# EAGLE design 8bitPig-PigstyGates-FrontPCB (EAGLE 9.2.2)
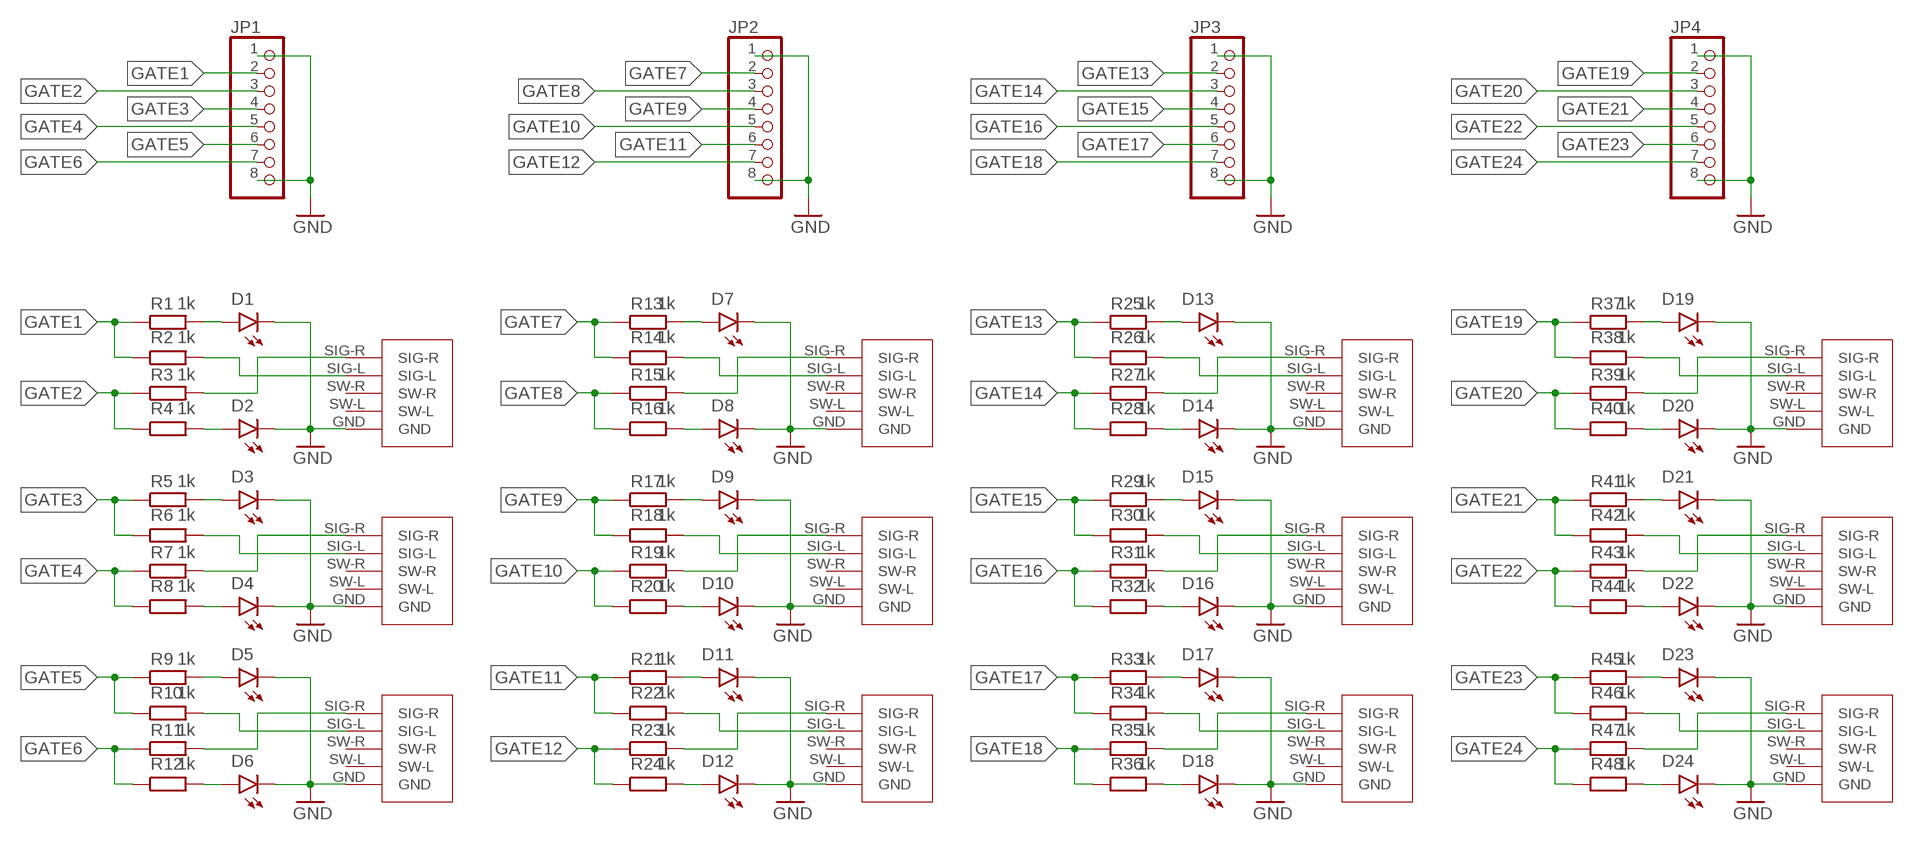
[diagram p0: schematic, sheet 1]

## Parts
D1  LED3MM  [LED_3MM]
D2  LED3MM  [LED_3MM]
D3  LED3MM  [LED_3MM]
D4  LED3MM  [LED_3MM]
D5  LED3MM  [LED_3MM]
D6  LED3MM  [LED_3MM]
D7  LED3MM  [LED_3MM]
D8  LED3MM  [LED_3MM]
D9  LED3MM  [LED_3MM]
D10  LED3MM  [LED_3MM]
D11  LED3MM  [LED_3MM]
D12  LED3MM  [LED_3MM]
D13  LED3MM  [LED_3MM]
D14  LED3MM  [LED_3MM]
D15  LED3MM  [LED_3MM]
D16  LED3MM  [LED_3MM]
D17  LED3MM  [LED_3MM]
D18  LED3MM  [LED_3MM]
D19  LED3MM  [LED_3MM]
D20  LED3MM  [LED_3MM]
D21  LED3MM  [LED_3MM]
D22  LED3MM  [LED_3MM]
D23  LED3MM  [LED_3MM]
D24  LED3MM  [LED_3MM]
DUAL_JACK_1  DUAL_MONO_THONKICONN  [DUAL_THONKICONN_MONO]
DUAL_JACK_2  DUAL_MONO_THONKICONN  [DUAL_THONKICONN_MONO]
DUAL_JACK_3  DUAL_MONO_THONKICONN  [DUAL_THONKICONN_MONO]
DUAL_JACK_4  DUAL_MONO_THONKICONN  [DUAL_THONKICONN_MONO]
DUAL_JACK_5  DUAL_MONO_THONKICONN  [DUAL_THONKICONN_MONO]
DUAL_JACK_6  DUAL_MONO_THONKICONN  [DUAL_THONKICONN_MONO]
DUAL_JACK_7  DUAL_MONO_THONKICONN  [DUAL_THONKICONN_MONO]
DUAL_JACK_8  DUAL_MONO_THONKICONN  [DUAL_THONKICONN_MONO]
DUAL_JACK_9  DUAL_MONO_THONKICONN  [DUAL_THONKICONN_MONO]
DUAL_JACK_10  DUAL_MONO_THONKICONN  [DUAL_THONKICONN_MONO]
DUAL_JACK_11  DUAL_MONO_THONKICONN  [DUAL_THONKICONN_MONO]
DUAL_JACK_12  DUAL_MONO_THONKICONN  [DUAL_THONKICONN_MONO]
JP1  PINHD-1X8  [1X08]
JP2  PINHD-1X8  [1X08]
JP3  PINHD-1X8  [1X08]
JP4  PINHD-1X8  [1X08]
R1  1k  R-EU_R0603  [R0603]
R2  1k  R-EU_R0603  [R0603]
R3  1k  R-EU_R0603  [R0603]
R4  1k  R-EU_R0603  [R0603]
R5  1k  R-EU_R0603  [R0603]
R6  1k  R-EU_R0603  [R0603]
R7  1k  R-EU_R0603  [R0603]
R8  1k  R-EU_R0603  [R0603]
R9  1k  R-EU_R0603  [R0603]
R10  1k  R-EU_R0603  [R0603]
R11  1k  R-EU_R0603  [R0603]
R12  1k  R-EU_R0603  [R0603]
R13  1k  R-EU_R0603  [R0603]
R14  1k  R-EU_R0603  [R0603]
R15  1k  R-EU_R0603  [R0603]
R16  1k  R-EU_R0603  [R0603]
R17  1k  R-EU_R0603  [R0603]
R18  1k  R-EU_R0603  [R0603]
R19  1k  R-EU_R0603  [R0603]
R20  1k  R-EU_R0603  [R0603]
R21  1k  R-EU_R0603  [R0603]
R22  1k  R-EU_R0603  [R0603]
R23  1k  R-EU_R0603  [R0603]
R24  1k  R-EU_R0603  [R0603]
R25  1k  R-EU_R0603  [R0603]
R26  1k  R-EU_R0603  [R0603]
R27  1k  R-EU_R0603  [R0603]
R28  1k  R-EU_R0603  [R0603]
R29  1k  R-EU_R0603  [R0603]
R30  1k  R-EU_R0603  [R0603]
R31  1k  R-EU_R0603  [R0603]
R32  1k  R-EU_R0603  [R0603]
R33  1k  R-EU_R0603  [R0603]
R34  1k  R-EU_R0603  [R0603]
R35  1k  R-EU_R0603  [R0603]
R36  1k  R-EU_R0603  [R0603]
R37  1k  R-EU_R0603  [R0603]
R38  1k  R-EU_R0603  [R0603]
R39  1k  R-EU_R0603  [R0603]
R40  1k  R-EU_R0603  [R0603]
R41  1k  R-EU_R0603  [R0603]
R42  1k  R-EU_R0603  [R0603]
R43  1k  R-EU_R0603  [R0603]
R44  1k  R-EU_R0603  [R0603]
R45  1k  R-EU_R0603  [R0603]
R46  1k  R-EU_R0603  [R0603]
R47  1k  R-EU_R0603  [R0603]
R48  1k  R-EU_R0603  [R0603]

## Nets
GATE1: JP1.2 R1.1 R2.1
GATE2: JP1.3 R3.1 R4.1
GATE3: JP1.4 R5.1 R6.1
GATE4: JP1.5 R7.1 R8.1
GATE5: JP1.6 R9.1 R10.1
GATE6: JP1.7 R11.1 R12.1
GATE7: JP2.2 R13.1 R14.1
GATE8: JP2.3 R15.1 R16.1
GATE9: JP2.4 R17.1 R18.1
GATE10: JP2.5 R19.1 R20.1
GATE11: JP2.6 R21.1 R22.1
GATE12: JP2.7 R23.1 R24.1
GATE13: JP3.2 R25.1 R26.1
GATE14: JP3.3 R27.1 R28.1
GATE15: JP3.4 R29.1 R30.1
GATE16: JP3.5 R31.1 R32.1
GATE17: JP3.6 R33.1 R34.1
GATE18: JP3.7 R35.1 R36.1
GATE19: JP4.2 R37.1 R38.1
GATE20: JP4.3 R39.1 R40.1
GATE21: JP4.4 R41.1 R42.1
GATE22: JP4.5 R43.1 R44.1
GATE23: JP4.6 R45.1 R46.1
GATE24: JP4.7 R47.1 R48.1
GND: D1.K(C) D2.K(C) D3.K(C) D4.K(C) D5.K(C) D6.K(C) D7.K(C) D8.K(C) D9.K(C) D10.K(C) D11.K(C) D12.K(C) D13.K(C) D14.K(C) D15.K(C) D16.K(C) D17.K(C) D18.K(C) D19.K(C) D20.K(C) D21.K(C) D22.K(C) D23.K(C) D24.K(C) DUAL_JACK_1.GND DUAL_JACK_2.GND DUAL_JACK_3.GND DUAL_JACK_4.GND DUAL_JACK_5.GND DUAL_JACK_6.GND DUAL_JACK_7.GND DUAL_JACK_8.GND DUAL_JACK_9.GND DUAL_JACK_10.GND DUAL_JACK_11.GND DUAL_JACK_12.GND JP1.1 JP1.8 JP2.1 JP2.8 JP3.1 JP3.8 JP4.1 JP4.8
N$1: DUAL_JACK_2.SIG-R R7.2
N$2: DUAL_JACK_1.SIG-L R2.2
N$3: D4.A R8.2
N$4: D3.A R5.2
N$5: D1.A R1.2
N$6: DUAL_JACK_2.SIG-L R6.2
N$7: DUAL_JACK_3.SIG-R R11.2
N$8: D6.A R12.2
N$9: D5.A R9.2
N$10: DUAL_JACK_3.SIG-L R10.2
N$11: DUAL_JACK_4.SIG-R R15.2
N$12: D8.A R16.2
N$13: D7.A R13.2
N$14: DUAL_JACK_4.SIG-L R14.2
N$15: DUAL_JACK_5.SIG-R R19.2
N$16: D10.A R20.2
N$17: DUAL_JACK_1.SIG-R R3.2
N$18: D9.A R17.2
N$19: DUAL_JACK_5.SIG-L R18.2
N$20: DUAL_JACK_6.SIG-R R23.2
N$21: D2.A R4.2
N$22: D12.A R24.2
N$23: D11.A R21.2
N$24: DUAL_JACK_6.SIG-L R22.2
N$25: DUAL_JACK_7.SIG-R R27.2
N$26: D14.A R28.2
N$27: D13.A R25.2
N$28: DUAL_JACK_7.SIG-L R26.2
N$29: DUAL_JACK_8.SIG-R R31.2
N$30: D16.A R32.2
N$31: D15.A R29.2
N$32: DUAL_JACK_8.SIG-L R30.2
N$33: DUAL_JACK_9.SIG-R R35.2
N$34: D18.A R36.2
N$35: D17.A R33.2
N$36: DUAL_JACK_9.SIG-L R34.2
N$37: DUAL_JACK_10.SIG-R R39.2
N$38: D20.A R40.2
N$39: D19.A R37.2
N$40: DUAL_JACK_10.SIG-L R38.2
N$41: DUAL_JACK_11.SIG-R R43.2
N$42: D22.A R44.2
N$43: D21.A R41.2
N$44: DUAL_JACK_11.SIG-L R42.2
N$45: DUAL_JACK_12.SIG-R R47.2
N$46: D24.A R48.2
N$47: D23.A R45.2
N$48: DUAL_JACK_12.SIG-L R46.2
Unconnected: DUAL_JACK_1.SW-L DUAL_JACK_1.SW-R DUAL_JACK_2.SW-L DUAL_JACK_2.SW-R DUAL_JACK_3.SW-L DUAL_JACK_3.SW-R DUAL_JACK_4.SW-L DUAL_JACK_4.SW-R DUAL_JACK_5.SW-L DUAL_JACK_5.SW-R DUAL_JACK_6.SW-L DUAL_JACK_6.SW-R DUAL_JACK_7.SW-L DUAL_JACK_7.SW-R DUAL_JACK_8.SW-L DUAL_JACK_8.SW-R DUAL_JACK_9.SW-L DUAL_JACK_9.SW-R DUAL_JACK_10.SW-L DUAL_JACK_10.SW-R DUAL_JACK_11.SW-L DUAL_JACK_11.SW-R DUAL_JACK_12.SW-L DUAL_JACK_12.SW-R

## Library data of the parts
D1-D24 = SparkFun-LED:LED: LED (Generic) Standard schematic elements and footprints for 5mm, 3mm, 1206, and 0603 sized LEDs. Generic LEDs with no color specified.; PROD_ID: DIO-08794
DUAL_JACK_1-DUAL_JACK_12 = SchnitzelsComponents:DUAL_MONO_THONKICONN
JP1-JP4 = pinhead:PINHD-1X8: PIN HEADER
R1-R48 = resistor:R-EU_: RESISTOR, European symbol

## Net classes
0 default: width 0.508 mm, clearance 0.635 mm

## Board
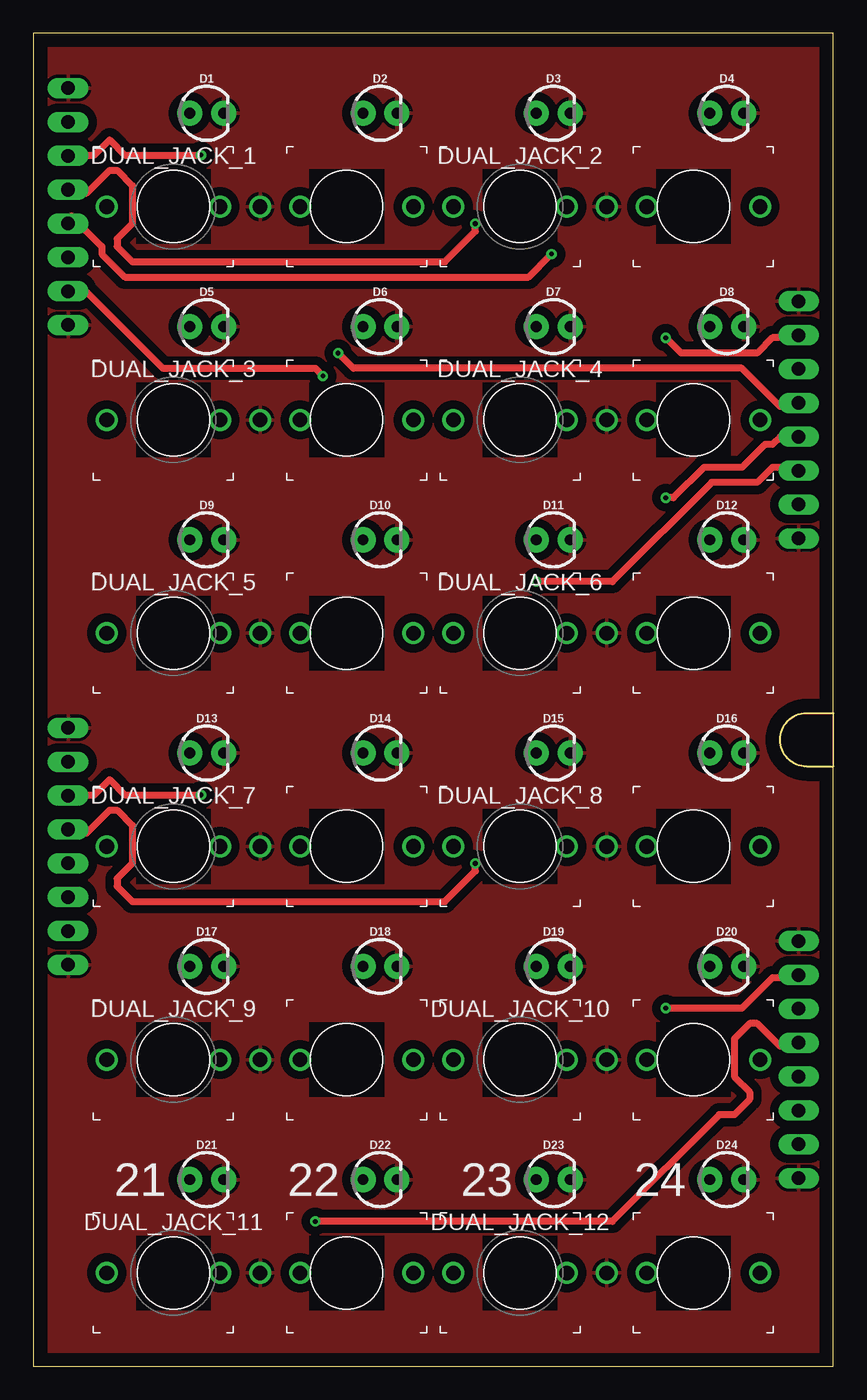
[diagram p1: board, top side]
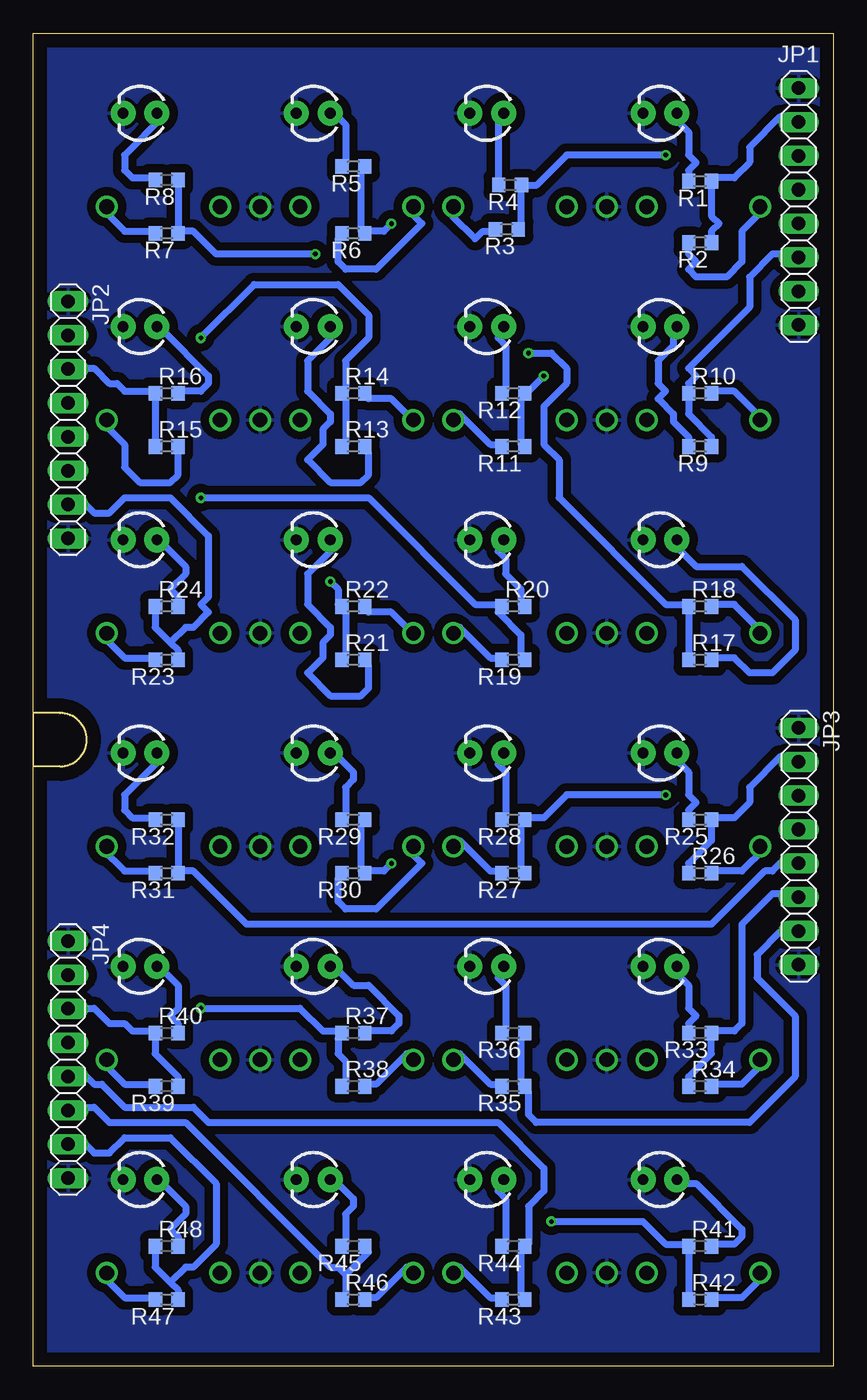
[diagram p2: board, bottom side, seen from below]

Size 60 x 100 mm. Coordinates in mm from the lower left corner, seen from the top.
Outline: 0,0 60,0 60,100 0,100 0,0
Copper layers (1*16): Top 0.035mm / dielectric 1.5mm / Bottom 0.035mm
Design rules "default": minimum track width 6mil, minimum drill 0.35mm, track to track 6mil, track to pad 6mil, pad to pad 6mil, via to via 6mil, smd to smd 6mil, copper to edge 40mil, drill to drill 6mil, minimum pad ring 10mil, minimum via ring 8mil, stop-mask expansion 4mil, vias tented up to drill 0mil, thermal gap 10mil

### Footprints (pad centres in the part's own frame; a part is rotated, then mirrored left to right if it is on the bottom)
LED_3MM = drill 0.813 pad 1.88: A -1.27,0; K 1.27,0
DUAL_THONKICONN_MONO = drill 1.1: GND 6.5,0; SIG-L -5,0; SIG-R 18,0; SW-L 3.5,0; SW-R 9.5,0
1X08 = drill 1.016 long: 1 -8.89,0; 2 -6.35,0; 3 -3.81,0; 4 -1.27,0; 5 1.27,0; 6 3.81,0; 7 6.35,0; 8 8.89,0
R0603 = smd 1 x 1.1: 1 -0.85,0; 2 0.85,0

### Placement (x,y rotation side)
D1  13,94 0 top
D2  26,94 0 top
D3  39,94 0 top
D4  52,94 0 top
D5  13,78 0 top
D6  26,78 0 top
D7  39,78 0 top
D8  52,78 0 top
D9  13,62 0 top
D10  26,62 0 top
D11  39,62 0 top
D12  52,62 0 top
D13  13,46 0 top
D14  26,46 0 top
D15  39,46 0 top
D16  52,46 0 top
D17  13,30 0 top
D18  26,30 0 top
D19  39,30 0 top
D20  52,30 0 top
D21  13,14 0 top
D22  26,14 0 top
D23  39,14 0 top
D24  52,14 0 top
DUAL_JACK_1  10.5,87 0 top
DUAL_JACK_2  36.5,87 0 top
DUAL_JACK_3  10.5,71 0 top
DUAL_JACK_4  36.5,71 0 top
DUAL_JACK_5  10.5,55 0 top
DUAL_JACK_6  36.5,55 0 top
DUAL_JACK_7  10.5,39 0 top
DUAL_JACK_8  36.5,39 0 top
DUAL_JACK_9  10.5,23 0 top
DUAL_JACK_10  36.5,23 0 top
DUAL_JACK_11  10.5,7 0 top
DUAL_JACK_12  36.5,7 0 top
JP1  2.6,87 270 bottom
JP2  57.4,71 270 bottom
JP3  2.6,39 270 bottom
JP4  57.4,23 270 bottom
R1  10,88.9 180 bottom
R2  10,84.3 180 bottom
R3  24.48,85.3 180 bottom
R4  24.24,88.62 180 bottom
R5  36,90 180 bottom
R6  36,85 180 bottom
R7  50,85 180 bottom
R8  50,89 180 bottom
R9  10,69 180 bottom
R10  10,73 0 bottom
R11  24,69 180 bottom
R12  24,73 180 bottom
R13  36,69 0 bottom
R14  36,73 0 bottom
R15  50,69 0 bottom
R16  50,73 0 bottom
R17  10,53 0 bottom
R18  10,57 0 bottom
R19  24,53 180 bottom
R20  24,57 0 bottom
R21  36,53 0 bottom
R22  36,57 0 bottom
R23  50,53 180 bottom
R24  50,57 0 bottom
R25  10,41 180 bottom
R26  10,37 0 bottom
R27  24,37 180 bottom
R28  24,41 180 bottom
R29  36,41 180 bottom
R30  36,37 180 bottom
R31  50,37 180 bottom
R32  50,41 180 bottom
R33  10,25 180 bottom
R34  10,21 0 bottom
R35  24,21 180 bottom
R36  24,25 180 bottom
R37  36,25 0 bottom
R38  36,21 0 bottom
R39  50,21 180 bottom
R40  50,25 0 bottom
R41  10,9 0 bottom
R42  10,5 0 bottom
R43  24,5 180 bottom
R44  24,9 180 bottom
R45  36,9 180 bottom
R46  36,5 0 bottom
R47  50,5 180 bottom
R48  50,9 0 bottom
U$1  [PANEL_CABLE_CUTOUT]  60,47 180 top

### Tracks (layer width: path | path; a pad name or v marks a point on that pad's centre or on a via)
GATE1
  Bottom 0.508: R2.1 9.14,84.58 9.14,85.15 8.57,85.72 9.14,86.3 9.14,88.58 R1.1 9.14,89.15 7.43,89.15 6.29,90.3 6.29,91.44 4,93.73 2.86,93.73 JP1.2
GATE2  (via drill 0.35)
  Top 0.508: v12.57,90.87 6.86,90.87 5.71,92.01 4.57,90.87 2.86,90.87 JP1.3
  Bottom 0.508: 23.43,88.58 23.43,85.72 R3.1 | 23.43,88.58 22.29,88.58 20,90.87 v12.57,90.87 | 23.43,88.58 R4.1
GATE3  (via drill 0.35)
  Top 0.508: v33.15,85.72 33.15,85.15 30.86,82.87 7.43,82.87 6.29,84.01 6.29,84.58 7.43,85.72 7.43,88.58 6.29,89.72 5.71,89.72 4,88.01 2.86,88.01 JP1.4
  Bottom 0.508: R5.1 35.43,89.72 35.43,85.15 R6.1 34.86,85.15 33.72,85.15 v33.15,85.72
GATE4  (via drill 0.35)
  Top 0.508: v38.86,83.44 37.15,81.72 6.86,81.72 5.14,83.44 5.14,84.01 2.86,86.3 JP1.5
  Bottom 0.508: 49.15,85.15 49.15,88.58 R8.1 | 49.15,85.15 48.01,85.15 46.29,83.44 v38.86,83.44 | 49.15,85.15 R7.1
GATE5
  Bottom 0.508: R9.1 9.14,69.15 9.14,69.72 10.86,71.44 10.86,72.58 R10.1 10.86,73.15 10.86,73.72 10.29,74.3 10.86,74.87 6.29,79.44 6.29,81.72 4.57,83.44 2.86,83.44 JP1.6
GATE6  (via drill 0.35)
  Top 0.508: v21.72,74.3 21.14,74.87 9.72,74.87 4,80.58 2.86,80.58 JP1.7
  Bottom 0.508: R11.1 23.43,69.15 23.43,72.58 R12.1 22.86,73.15 v21.72,74.3
GATE7  (via drill 0.35)
  Top 0.508: v47.43,77.15 48.58,76.01 54.29,76.01 55.44,77.15 57.15,77.15 JP2.2
  Bottom 0.508: R13.1 36.58,69.15 36.58,72.58 R14.1 36.58,73.15 36.58,75.44 34.86,77.15 34.86,78.87 37.15,81.15 43.43,81.15 v47.43,77.15
GATE8
  Bottom 0.508: R15.1 50.86,69.15 50.86,72.58 R16.1 50.86,73.15 53.15,73.15 53.72,73.72 54.29,73.72 55.44,74.87 57.15,74.87 JP2.3
GATE9  (via drill 0.35)
  Top 0.508: v22.86,76.01 24,74.87 53.15,74.87 56.01,72.01 57.15,72.01 JP2.4
  Bottom 0.508: R17.1 10.86,53.15 10.86,56.58 R18.1 10.86,57.15 12.57,57.15 20.57,65.15 20.57,68.01 21.72,69.15 21.72,72.01 20,73.72 20,74.87 21.14,76.01 v22.86,76.01
GATE10  (via drill 0.35)
  Top 0.508: v47.43,65.15 48.01,65.15 50.29,67.44 53.15,67.44 54.86,69.15 55.44,69.15 56.01,69.72 57.15,69.72 JP2.5
  Bottom 0.508: R19.1 23.43,53.15 23.43,54.86 25.15,56.58 R20.1 25.15,57.15 26.86,57.15 34.86,65.15 v47.43,65.15
GATE11  (via drill 0.35)
  Top 0.508: v37.72,58.86 43.43,58.86 50.86,66.29 54.29,66.29 55.44,67.44 57.15,67.44 JP2.6
  Bottom 0.508: R21.1 36.58,53.15 36.58,56.58 R22.1 37.15,57.15 37.15,58.29 v37.72,58.86
GATE12
  Bottom 0.508: 49.72,54.29 50.86,55.44 50.86,56.58 R24.1 | 49.72,54.29 49.15,53.72 49.15,53.15 R23.1 | 49.72,54.29 48.58,55.44 48.01,55.44 46.86,56.58 47.43,57.15 46.86,57.72 46.86,62.29 49.72,65.15 53.15,65.15 54.29,64.01 55.44,64.01 56.01,64.58 57.15,64.58 JP2.7
GATE13
  Bottom 0.508: R26.1 10.86,37.15 10.86,37.72 9.14,39.43 9.14,40.58 R25.1 9.14,41.15 7.43,41.15 6.29,42.29 6.29,43.43 4,45.72 2.86,45.72 JP3.2
GATE14  (via drill 0.35)
  Top 0.508: v12.57,42.86 6.86,42.86 5.71,44.01 4.57,42.86 2.86,42.86 JP3.3
  Bottom 0.508: R27.1 23.43,37.15 23.43,40.58 R28.1 22.86,41.15 21.72,41.15 20,42.86 v12.57,42.86
GATE15  (via drill 0.35)
  Top 0.508: v33.15,37.72 33.15,37.15 30.86,34.86 7.43,34.86 6.29,36.01 6.29,36.58 7.43,37.72 7.43,40.58 6.29,41.72 5.71,41.72 4,40.01 2.86,40.01 JP3.4
  Bottom 0.508: R29.1 35.43,40.58 35.43,37.15 R30.1 34.86,37.15 33.72,37.15 v33.15,37.72
GATE16
  Bottom 0.508: 49.15,37.15 49.15,40.58 R32.1 | 49.15,37.15 48.01,37.15 44.01,33.15 9.14,33.15 5.14,37.15 4.57,37.15 4,37.72 2.86,37.72 JP3.5 | 49.15,37.15 R31.1
GATE17
  Bottom 0.508: R34.1 10.86,21.14 10.86,21.72 9.14,23.43 9.14,24.57 R33.1 9.14,25.15 7.43,25.15 6.86,25.72 6.86,33.15 4.57,35.43 2.86,35.43 JP3.6
GATE18
  Bottom 0.508: R36.1 23.43,24.57 23.43,21.14 R35.1 22.86,20.57 22.86,18.86 22.29,18.29 6.29,18.29 2.86,21.72 2.86,26.29 5.71,29.15 5.71,30.86 4,32.58 2.86,32.58 JP3.7
GATE19  (via drill 0.35)
  Top 0.508: v47.43,26.86 53.15,26.86 55.44,29.15 57.15,29.15 JP4.2
  Bottom 0.508: R38.1 36.58,21.14 36.58,22.86 37.15,23.43 37.15,24.57 R37.1 37.15,25.15 38.29,25.15 40.01,26.86 v47.43,26.86
GATE20
  Bottom 0.508: R39.1 49.15,21.14 49.15,21.72 50.86,23.43 50.86,24.57 R40.1 50.86,25.15 52.58,25.15 53.15,25.72 54.29,25.72 55.44,26.86 57.15,26.86 JP4.3
GATE21  (via drill 0.35)
  Top 0.508: v21.14,10.86 43.43,10.86 51.44,18.86 52.58,18.86 53.72,20 53.72,20.57 52.58,21.72 52.58,24.57 53.72,25.72 54.29,25.72 56.01,24 57.15,24 JP4.4
  Bottom 0.508: R42.1 10.86,5.14 10.86,8.57 R41.1 10.86,9.14 12.57,9.14 14.29,10.86 v21.14,10.86
GATE22
  Bottom 0.508: R43.1 23.43,5.14 23.43,8.57 R44.1 22.86,9.14 22.86,12 21.72,13.14 21.72,14.86 25.15,18.29 46.86,18.29 48.01,19.43 53.15,19.43 54.86,21.14 55.44,21.14 56.01,21.72 57.15,21.72 JP4.5
GATE23
  Bottom 0.508: 36.58,6.86 36.58,5.14 R46.1 | 36.58,6.86 34.86,8.57 R45.1 | 36.58,6.86 37.15,7.43 37.72,7.43 48.58,18.29 54.29,18.29 55.44,19.43 57.15,19.43 JP4.6
GATE24
  Bottom 0.508: 49.72,6.29 50.86,7.43 50.86,8.57 R48.1 | 49.72,6.29 49.15,5.71 49.15,5.14 R47.1 | 49.72,6.29 48.58,7.43 48.01,7.43 46.29,9.14 46.29,13.72 49.72,17.14 53.15,17.14 54.29,16 55.44,16 56.01,16.57 57.15,16.57 JP4.7
GND
  pour Top: 1,99 59,99 59,1 1,1
  pour Bottom: 1,99 59,99 59,1 1,1
N$1
  Bottom 0.508: R7.2 50.86,85.15 53.15,85.15 54.86,86.87 DUAL_JACK_2.SIG-R
N$2
  Bottom 0.508: R2.2 10.86,84.01 10.86,83.44 10.29,82.87 10.86,82.3 10.29,81.72 8,81.72 6.86,82.87 6.86,85.15 5.14,86.87 DUAL_JACK_1.SIG-L
N$3
  Bottom 0.508: R8.2 50.86,89.15 52.58,89.15 53.15,89.72 53.15,90.87 50.29,93.73 D4.A
N$4
  Bottom 0.508: R5.2 36.58,90.3 36.58,93.15 37.72,94.3 D3.A
N$5
  Bottom 0.508: R1.2 10.86,89.15 10.86,89.72 10.29,90.3 10.86,90.87 10.86,92.58 12,93.73 D1.A
N$6
  Bottom 0.508: R6.2 37.15,84.58 37.15,82.87 36.58,82.3 34.29,82.3 30.86,85.72 32,86.87 DUAL_JACK_2.SIG-L
N$7
  Bottom 0.508: R11.2 25.15,69.15 25.72,69.15 28,71.44 DUAL_JACK_3.SIG-R
N$8
  Bottom 0.508: R12.2 24.57,73.15 24.57,76.58 25.15,77.15 25.15,77.72 D6.A
N$9
  Bottom 0.508: R9.2 10.86,69.15 10.86,69.72 12,70.87 12,71.44 13.14,72.58 12.57,73.15 13.14,73.72 13.14,75.44 12,76.58 12,77.72 D5.A
N$10
  Bottom 0.508: R10.2 9.14,73.15 7.43,73.15 5.71,71.44 DUAL_JACK_3.SIG-L
N$11
  Bottom 0.508: R15.2 49.15,68.58 49.15,66.86 49.72,66.29 52.01,66.29 53.15,67.44 53.15,69.15 54.86,70.87 DUAL_JACK_4.SIG-R
N$12
  Bottom 0.508: R16.2 49.15,73.15 47.43,73.15 46.86,73.72 46.86,74.3 50.29,77.72 D8.A
N$13
  Bottom 0.508: R13.2 34.86,68.58 34.86,66.86 35.43,66.29 37.72,66.29 39.43,68.01 38.29,69.15 38.29,70.29 37.72,70.87 37.72,71.44 39.43,73.15 39.43,75.44 37.15,77.72 37.72,78.3 D7.A
N$14
  Bottom 0.508: R14.2 34.86,72.58 33.15,72.58 32,71.44 DUAL_JACK_4.SIG-L
N$15
  Bottom 0.508: R19.2 25.15,53.15 25.72,53.15 28,55.44 DUAL_JACK_5.SIG-R
N$16
  Bottom 0.508: R20.2 23.43,57.15 23.43,58.29 24.57,59.44 24.57,60.58 25.15,61.15 25.15,61.72 D10.A
N$17
  Bottom 0.508: R3.2 25.72,85.15 26.29,85.15 26.86,84.58 28.57,86.3 28.57,86.87 DUAL_JACK_1.SIG-R
N$18
  Bottom 0.508: R17.2 9.14,53.15 7.43,53.15 6.29,52.01 4.57,52.01 2.86,53.72 2.86,56.01 6.86,60.01 10.29,60.01 12,61.72 D9.A
N$19
  Bottom 0.508: R18.2 9.14,57.15 7.43,57.15 5.71,55.44 DUAL_JACK_5.SIG-L
N$20
  Bottom 0.508: R23.2 50.86,53.15 53.15,53.15 54.86,54.86 DUAL_JACK_6.SIG-R
N$21
  Bottom 0.508: R4.2 25.15,89.15 25.15,93.73 D2.A
N$22
  Bottom 0.508: R24.2 49.15,57.15 49.15,57.72 49.72,58.29 48.58,59.44 48.58,60.01 50.29,61.72 D12.A
N$23
  Bottom 0.508: R21.2 34.86,52.58 34.86,50.86 35.43,50.29 37.72,50.29 39.43,52.01 38.29,53.15 38.29,54.29 37.72,54.86 37.72,55.44 39.43,57.15 39.43,59.44 37.15,61.72 37.72,62.29 D11.A
N$24
  Bottom 0.508: R22.2 34.86,56.58 33.15,56.58 32,55.44 DUAL_JACK_6.SIG-L
N$25
  Bottom 0.508: R27.2 25.15,37.15 25.72,37.15 28,39.43 DUAL_JACK_7.SIG-R
N$26
  Bottom 0.508: R28.2 24.57,41.15 24.57,44.58 25.15,45.15 25.15,45.72 D14.A
N$27
  Bottom 0.508: R25.2 10.86,41.15 10.86,41.72 10.29,42.29 10.86,42.86 10.86,44.58 12,45.72 D13.A
N$28
  Bottom 0.508: R26.2 9.14,37.15 6.86,37.15 5.14,38.86 DUAL_JACK_7.SIG-L
N$29
  Bottom 0.508: R31.2 50.86,37.15 53.15,37.15 54.86,38.86 DUAL_JACK_8.SIG-R
N$30
  Bottom 0.508: R32.2 50.86,41.15 52.58,41.15 53.15,41.72 53.15,42.86 50.29,45.72 D16.A
N$31
  Bottom 0.508: R29.2 36.58,41.15 36.58,43.43 36.01,44.01 36.01,44.58 37.72,46.29 D15.A
N$32
  Bottom 0.508: R30.2 37.15,36.58 37.15,34.86 36.58,34.29 34.29,34.29 30.86,37.72 32,38.86 DUAL_JACK_8.SIG-L
N$33
  Bottom 0.508: R35.2 25.15,21.14 25.72,21.14 28,23.43 DUAL_JACK_9.SIG-R
N$34
  Bottom 0.508: R36.2 24.57,25.15 24.57,28.57 25.15,29.15 25.15,29.72 D18.A
N$35
  Bottom 0.508: R33.2 10.86,25.15 10.86,25.72 10.29,26.29 10.86,26.86 10.86,28.57 12,29.72 D17.A
N$36
  Bottom 0.508: R34.2 9.14,21.14 6.86,21.14 5.14,22.86 DUAL_JACK_9.SIG-L
N$37
  Bottom 0.508: R39.2 50.86,21.14 53.15,21.14 54.86,22.86 DUAL_JACK_10.SIG-R
N$38
  Bottom 0.508: R40.2 49.15,25.15 49.15,25.72 49.72,26.29 49.15,26.86 49.15,28.57 50.29,29.72 D20.A
N$39
  Bottom 0.508: R37.2 34.86,25.15 33.15,25.15 32.58,25.72 32.58,26.29 34.86,28.57 36.01,28.57 37.72,30.29 D19.A
N$40
  Bottom 0.508: R38.2 34.86,21.14 34.29,21.14 32,23.43 DUAL_JACK_10.SIG-L
N$41
  Bottom 0.508: R43.2 25.15,5.14 25.72,5.14 28,7.43 DUAL_JACK_11.SIG-R
N$42
  Bottom 0.508: R44.2 24.57,9.14 24.57,12.57 25.15,13.14 25.15,13.72 D22.A
N$43
  Bottom 0.508: R41.2 9.14,9.14 7.43,9.14 6.86,9.72 6.86,10.29 10.29,13.72 11.43,13.72 D21.A
N$44
  Bottom 0.508: R42.2 9.14,5.14 6.86,5.14 5.14,6.86 DUAL_JACK_11.SIG-L
N$45
  Bottom 0.508: R47.2 50.86,5.14 53.15,5.14 54.86,6.86 DUAL_JACK_12.SIG-R
N$46
  Bottom 0.508: R48.2 49.15,9.14 49.15,9.72 49.72,10.29 48.58,11.43 48.58,12 50.29,13.72 D24.A
N$47
  Bottom 0.508: R45.2 36.58,9.14 36.58,11.43 36.01,12 36.01,12.57 37.72,14.29 D23.A
N$48
  Bottom 0.508: R46.2 34.86,5.14 34.29,5.14 32,7.43 DUAL_JACK_12.SIG-L

### Text on the board
tPlace: 21 | 22 | 23 | 24